# Altium schematic sheet P04 Power 1.SchDoc
size 420 x 297 mm
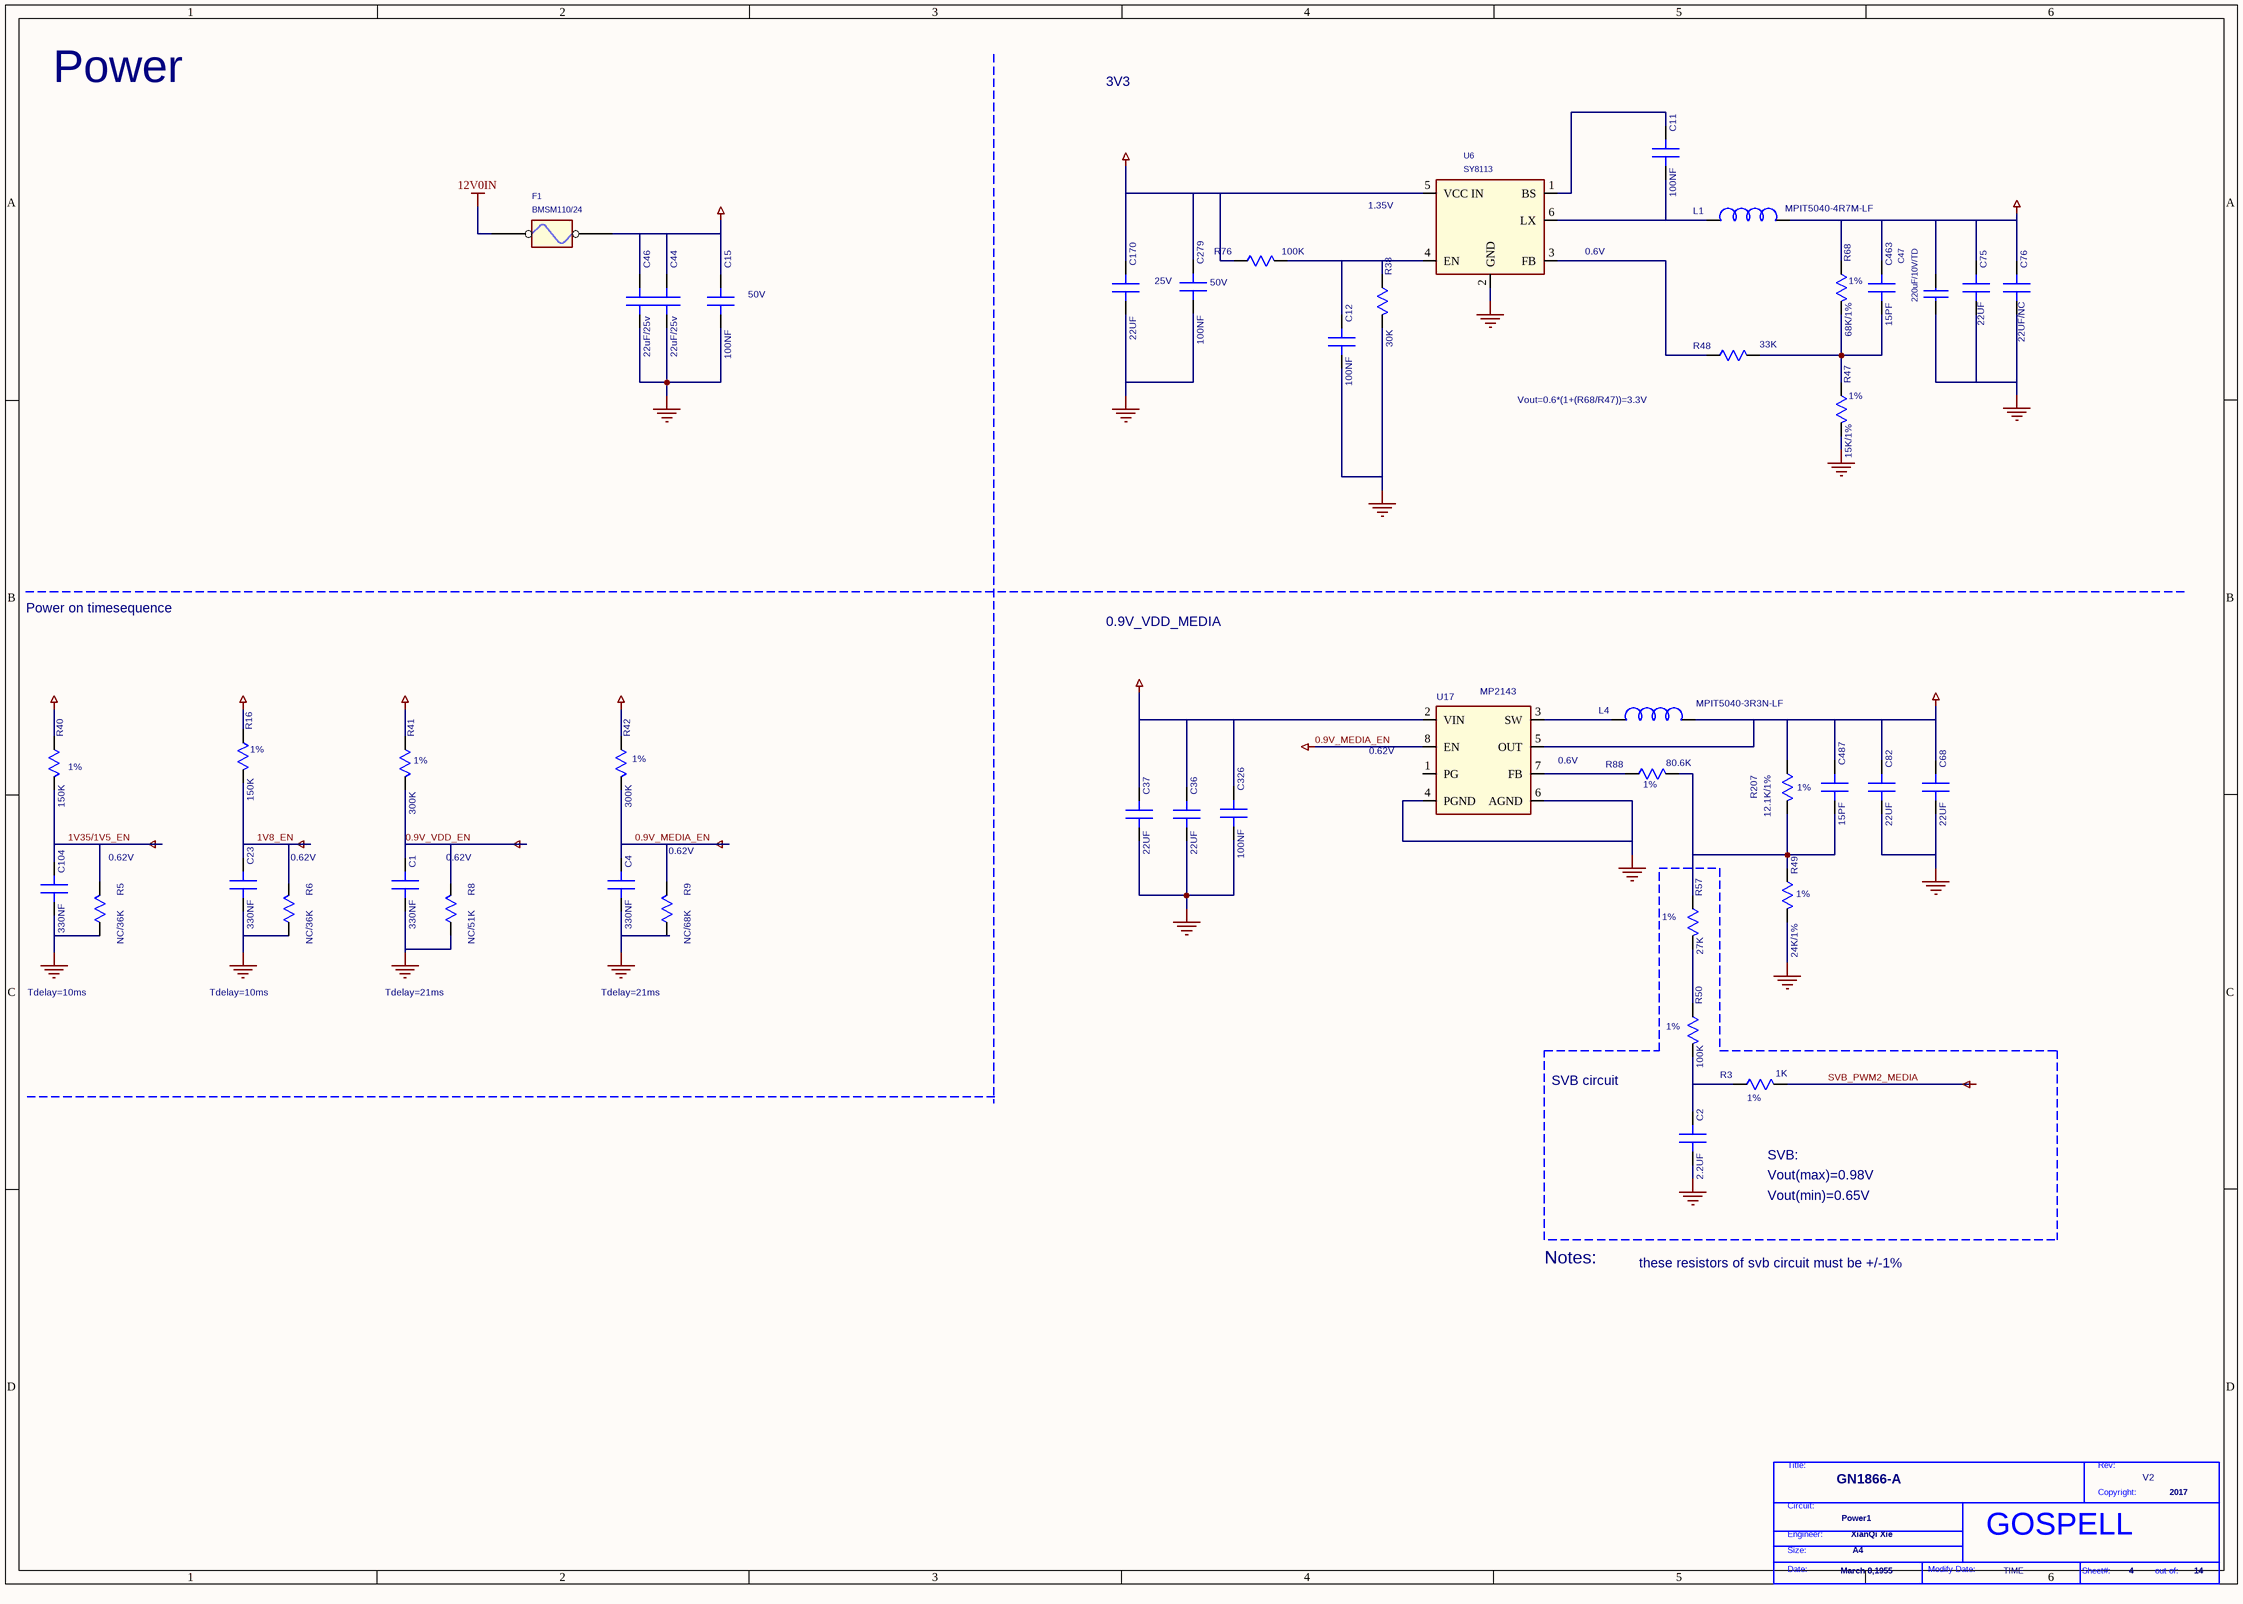
[diagram p0: P04 Power 1.SchDoc]

## Parts
*  Page Modify Date: TIME  Engineer: XianQi Xie  Copyright: 2017  Title: GN1866-A  RevCode: V2  Page Size: A4  Page Create Date: March 8,1955  Page Number: 4  Page Count: 14  Doc: Power1  (hidden comment: GOSPELL)  (graphical)
C1  330NF  [SC0402]
C2  2.2UF  [HSC0402]
C4  330NF  [SC0402]
C11  100NF  [SC0402]
C12  100NF  [SC0402]
C15  100NF  [SC0402]
C23  330NF  [SC0402]
C36  22UF  [SC1206]
C37  22UF  [SC1206]
C44  22uF/25v  [1210]
C46  22uF/25v  [1210]
C47  220uF/10V/TD  [C6032]
C68  22UF  [SC1206]
C75  22UF  [SC1206]
C76  22UF/NC  [SC1206]
C82  22UF  [SC1206]
C104  330NF  [SC0402]
C170  22UF  [SC1206]
C279  100NF  [SC0402]
C326  100NF  [SC0402]
C463  15PF  [SC0402]
C487  15PF  [SC0402]
F1  BMSM110/24  [1812]
L1  MPIT5040-4R7M-LF  [MPI5040]
L4  MPIT5040-3R3N-LF  [MPI5040]
R3  1K  [SR0402]
R5  NC/36K  [SR0402]
R6  NC/36K  [SR0402]
R8  NC/51K  [SR0402]
R9  NC/68K  [SR0402]
R16  150K  [SR0402]
R38  30K  [SR0402]
R40  150K  [SR0402]
R41  300K  [SR0402]
R42  300K  [SR0402]
R47  15K/1%  [SR0402]
R48  33K  [SR0402]
R49  24K/1%  [SR0402]
R50  100K  [SR0402]
R57  27K  [SR0402]
R68  68K/1%  [SR0402]
R76  100K  [SR0402]
R88  80.6K  [SR0402]
R207  12.1K/1%  [SR0402]
U6  SY8113  [SOT23-6]
U17  DEVICE: MP2143  [TSOT23-8]  (hidden comment: MP2161GJ)

## Nets
0.9V_MEDIA_EN: C4.1(A) R9.2(B) R42.2(B) U17.8(EN)
0.9V_VDD_EN: C1.1(A) R8.2(B) R41.2(B)
1V8_EN: C23.1(A) R6.2(B) R16.2(B)
1V35/1V5_EN: C104.1(A) R5.2(B) R40.2(B)
3V3: C36.1(A) C37.1(A) C47.1 C75.1(A) C76.1(A) C326.1(A) C463.1(A) L1.2(B) R16.1(A) R40.1(A) R41.1(A) R42.1(A) R68.1(A) U17.2(VIN)
12V0: C15.1(A) C44.1(A) C46.1(A) C170.1(A) C279.1(A) F1.2 R76.1(A) U6.5(VCC_IN)
12V0IN: F1.1
GND: C1.2(B) C2.2(B) C4.2(B) C12.2(B) C15.2(B) C23.2(B) C36.2(B) C37.2(B) C44.2(B) C46.2(B) C47.2 C68.2(B) C75.2(B) C76.2(B) C82.2(B) C104.2(B) C170.2(B) C279.2(B) C326.2(B) R5.1(A) R6.1(A) R8.1(A) R9.1(A) R38.2(B) R47.2(B) R49.2(B) U6.2(GND) U17.4(PGND) U17.6(AGND)
SVB_PWM2_MEDIA: R3.2(B)
VCC_MEDIA_CORE: C68.1(A) C82.1(A) C487.1(A) L4.2(B) R207.1(A) U17.5(OUT)
NetC2_1: C2.1(A) R3.1(A) R50.2(B)
NetC11_1: C11.1(A) U6.1(BS)
NetC11_2: C11.2(B) L1.1(A) U6.6(LX)
NetC12_1: C12.1(A) R38.1(A) R76.2(B) U6.4(EN)
NetC463_2: C463.2(B) R47.1(A) R48.2(B) R68.2(B)
NetC487_2: C487.2(B) R49.1(A) R57.1(A) R88.2(B) R207.2(B)
NetL4_1: L4.1(A) U17.3(SW)
NetR48_1: R48.1(A) U6.3(FB)
NetR50_1: R50.1(A) R57.2(B)
NetR88_1: R88.1(A) U17.7(FB)

Not connected (* = marked no-connect by the designer): U17 1(PG)

## Notes on the sheet
- Power
- 3V3
- (near U6) 1.35V
- (near U6) 0.6V
- (near C15) 50V
- 25V
- (near C279) 50V
- (near R68) 1%
- (near R47) 1%
- Vout=0.6*(1+(R68/R47))=3.3V
- Power on timesequence
- 0.9V_VDD_MEDIA
- (near R40) 1%
- (near R16) 1%
- (near R41) 1%
- (near R42) 1%
- (near U17) 0.62V
- (near U17) 0.6V
- (near R88) 1%
- (near R207) 1%
- (near R5) 0.62V
- 0.62V
- (near R57) 1%
- (near R49) 1%
- Tdelay=10ms
- Tdelay=21ms
- (near R50) 1%
- SVB circuit
- (near R3) 1%
- Vout(min)=0.65V
- Vout(max)=0.98V
- SVB:
- Notes:
- these resistors of svb circuit must be +/-1%
- (in symbol GOSPELL) Title:; Rev:; Copyright:; Circuit:; Engineer:; Size:; Date:; Modify Date:; Sheet#:; out of:

## Library data of the parts
C1 = C_0_Dup2: PARTS: 1; OriginalSymbolOrigin: (0,30); DEVICE: C0603C334K4RAC7867; PKG_TYPE: SC0603; LEVEL: STD; PINSWAP: (A,B); GVALUE: C 16V  0.33uF +80%~-20%  X7R 0402; CODE: 8070857; %195%%232%%202%%246%: SMD陶瓷电容-16V-330NF-+/-10%-X7R-0603-所有; %182%%238%%182%%168%%185%%164%%215%%247%%181%%231%%209%%185%(V): 16; COMPONENT_HIGH_MAX: 0.9MM; %208%%161%%192%%224%%195%%251%%179%%198%: SMD陶瓷电容
C2 = C_0_Dup2: PARTS: 1; OriginalSymbolOrigin: (0,30); DEVICE: GRM155R60J225ME15D; LEVEL: STD; PINSWAP: (A,B); CODE: 8070667; %195%%232%%202%%246%: SMD陶瓷电容-6.3V-2200NF-+/-20%-X5R-0402-TS16949; %182%%238%%182%%168%%185%%164%%215%%247%%181%%231%%209%%185%(V): 6.3; COMPONENT_HIGH_MAX: 0.6MM; %208%%161%%192%%224%%195%%251%%179%%198%: SMD陶瓷电容; GVALUE: C  6.3V  2.2uF +80%~-20%  X5R 0402; PKG_TYPE: HSC0402
C4 C23 C104 = C_0_Dup2: PARTS: 1; OriginalSymbolOrigin: (0,30); DEVICE: C0603C334K4RAC7867; PKG_TYPE: SC0603; LEVEL: STD; PINSWAP: (A,B); GVALUE: C 16V  0.33uF +80%~-20%  X7R 0402; %208%%161%%192%%224%%195%%251%%179%%198%: SMD陶瓷电容; COMPONENT_HIGH_MAX: 0.9MM; %182%%238%%182%%168%%185%%164%%215%%247%%181%%231%%209%%185%(V): 16; %195%%232%%202%%246%: SMD陶瓷电容-16V-330NF-+/-10%-X7R-0603-所有; CODE: 8070857
C11 = C_0_Dup2: PARTS: 1; OriginalSymbolOrigin: (0,30); DEVICE: RMEMK105BJ104KV_FR; LEVEL: STD; PINSWAP: (A,B); GVALUE: C 16V  0.1uF +80%~-20%  X7R 0402; %208%%161%%192%%224%%195%%251%%179%%198%: SMD陶瓷电容; COMPONENT_HIGH_MAX: 0.55MM; %182%%238%%182%%168%%185%%164%%215%%247%%181%%231%%209%%185%(V): 16; %195%%232%%202%%246%: SMD陶瓷电容-16V-100NF-+/-10%-X7R-0402-BT; CODE: 8070614; PKG_TYPE: SC0402
C12 = C_0_Dup2: PARTS: 1; OriginalSymbolOrigin: (0,30); DEVICE: RMEMK105BJ104KV_FR; LEVEL: STD; PINSWAP: (A,B); GVALUE: C 16V  0.1uF +80%~-20%  X7R 0402; CODE: 8070614; %195%%232%%202%%246%: SMD陶瓷电容-16V-100NF-+/-10%-X7R-0402-BT; %182%%238%%182%%168%%185%%164%%215%%247%%181%%231%%209%%185%(V): 16; COMPONENT_HIGH_MAX: 0.55MM; %208%%161%%192%%224%%195%%251%%179%%198%: SMD陶瓷电容; PKG_TYPE: SC0402
C15 = C_0_Dup2: PARTS: 1; OriginalSymbolOrigin: (0,30); DEVICE: C1608X7R1H104KT000N; PKG_TYPE: SC0603; LEVEL: STD; PINSWAP: (A,B); GVALUE: C 16V  0.1uF +80%~-20%  X7R 0402; CODE: 8070627; %195%%232%%202%%246%: SMD陶瓷电容-50V-100NF-+/-10%-X7R-0603; %182%%238%%182%%168%%185%%164%%215%%247%%181%%231%%209%%185%(V): 50; COMPONENT_HIGH_MAX: 0.95MM; %208%%161%%192%%224%%195%%251%%179%%198%: SMD陶瓷电容
C36 C82 = C_0_Dup2: PARTS: 1; OriginalSymbolOrigin: (0,30); DEVICE: C3216X6S0J476MTJ00N; LEVEL: STD; PINSWAP: (A,B); %208%%161%%192%%224%%195%%251%%179%%198%: SMD陶瓷电容; COMPONENT_HIGH_MAX: 1.8MM; %182%%238%%182%%168%%185%%164%%215%%247%%181%%231%%209%%185%(V): 6.3; %195%%232%%202%%246%: SMD陶瓷电容-6.3V-47000NF-+/-20%-X6S-1206-供电专用; CODE: 8071639; GVALUE: C  6.3V  22uF +80%~-20%  X5R 1206; PKG_TYPE: SC1206
C37 C68 = C_0_Dup2: PARTS: 1; OriginalSymbolOrigin: (0,30); DEVICE: CEJMK316B7226ML_T; LEVEL: STD; PINSWAP: (A,B); %208%%161%%192%%224%%195%%251%%179%%198%: SMD陶瓷电容; COMPONENT_HIGH_MAX: 1.8MM; %182%%238%%182%%168%%185%%164%%215%%247%%181%%231%%209%%185%(V): 6.3; %195%%232%%202%%246%: SMD陶瓷电容-6.3V-22000NF-+/-20%-X7R-1206-所有; CODE: 8070862; GVALUE: C  6.3V  22uF +80%~-20%  X5R 1206; PKG_TYPE: SC1206
C44 = C_0_Dup2: PARTS: 1; OriginalSymbolOrigin: (0,30); DEVICE: C1608X7R1H104KT000N; PKG_TYPE: SC0603; LEVEL: STD; PINSWAP: (A,B); %208%%161%%192%%224%%195%%251%%179%%198%: SMD陶瓷电容; COMPONENT_HIGH_MAX: 0.95MM; %182%%238%%182%%168%%185%%164%%215%%247%%181%%231%%209%%185%(V): 50; %195%%232%%202%%246%: SMD陶瓷电容-50V-100NF-+/-10%-X7R-0603; CODE: 8070627; GVALUE: C  25V  22uF +80%~-20%  X7R 1210
C46 = C_0_Dup2: PARTS: 1; OriginalSymbolOrigin: (0,30); DEVICE: C1608X7R1H104KT000N; PKG_TYPE: SC0603; LEVEL: STD; PINSWAP: (A,B); GVALUE: C  25V  22uF +80%~-20%  X7R 1210; CODE: 8070627; %195%%232%%202%%246%: SMD陶瓷电容-50V-100NF-+/-10%-X7R-0603; %182%%238%%182%%168%%185%%164%%215%%247%%181%%231%%209%%185%(V): 50; COMPONENT_HIGH_MAX: 0.95MM; %208%%161%%192%%224%%195%%251%%179%%198%: SMD陶瓷电容
C47 = CAP NP: GVALUE: CT 6.3V/220uF±20% 6032
C75 = C_0_Dup2: PARTS: 1; OriginalSymbolOrigin: (0,30); DEVICE: C3216X6S0J476MTJ00N; LEVEL: STD; PINSWAP: (A,B); CODE: 8071639; %195%%232%%202%%246%: SMD陶瓷电容-6.3V-47000NF-+/-20%-X6S-1206-供电专用; %182%%238%%182%%168%%185%%164%%215%%247%%181%%231%%209%%185%(V): 6.3; COMPONENT_HIGH_MAX: 1.8MM; %208%%161%%192%%224%%195%%251%%179%%198%: SMD陶瓷电容; GVALUE: C  6.3V  22uF +80%~-20%  X5R 1206; PKG_TYPE: SC1206
C76 = C_0_Dup2: PARTS: 1; OriginalSymbolOrigin: (0,30); DEVICE: CEJMK316B7226ML_T; LEVEL: STD; PINSWAP: (A,B); %208%%161%%192%%224%%195%%251%%179%%198%: SMD陶瓷电容; COMPONENT_HIGH_MAX: 1.8MM; %182%%238%%182%%168%%185%%164%%215%%247%%181%%231%%209%%185%(V): 6.3; %195%%232%%202%%246%: SMD陶瓷电容-6.3V-22000NF-+/-20%-X7R-1206-所有; CODE: 8070862; GVALUE: NC; PKG_TYPE: SC1206
C170 = C_0_Dup2: PARTS: 1; OriginalSymbolOrigin: (0,30); DEVICE: CETMK325B7226KM_T; PKG_TYPE: SC1210; LEVEL: STD; PINSWAP: (A,B); %208%%161%%192%%224%%195%%251%%179%%198%: SMD陶瓷电容; COMPONENT_HIGH_MAX: 2.7MM; %182%%238%%182%%168%%185%%164%%215%%247%%181%%231%%209%%185%(V): 25; %195%%232%%202%%246%: SMD陶瓷电容-25V-22000NF-+/-10%-X7R-1210-所有; CODE: 8070825; GVALUE: C  6.3V  22uF +80%~-20%  X5R 1206
C279 = C_0_Dup2: PARTS: 1; OriginalSymbolOrigin: (0,30); DEVICE: C1608X7R1H104KT000N; PKG_TYPE: SC0603; LEVEL: STD; PINSWAP: (A,B); GVALUE: C 16V  0.1uF +80%~-20%  X7R 0402; %208%%161%%192%%224%%195%%251%%179%%198%: SMD陶瓷电容; COMPONENT_HIGH_MAX: 0.9MM; %182%%238%%182%%168%%185%%164%%215%%247%%181%%231%%209%%185%(V): 50; %195%%232%%202%%246%: SMD陶瓷电容-50V-100NF-+/-10%-X7R-0603; CODE: 8070627
C326 = C_0_Dup2: PARTS: 1; OriginalSymbolOrigin: (0,30); DEVICE: C1608X7R1H104KT000N; PKG_TYPE: SC0603; LEVEL: STD; PINSWAP: (A,B); GVALUE: C 16V  0.1uF +80%~-20%  X7R 0402; CODE: 8070627; %195%%232%%202%%246%: SMD陶瓷电容-50V-100NF-+/-10%-X7R-0603; %182%%238%%182%%168%%185%%164%%215%%247%%181%%231%%209%%185%(V): 50; COMPONENT_HIGH_MAX: 0.9MM; %208%%161%%192%%224%%195%%251%%179%%198%: SMD陶瓷电容
C463 = C_0_Dup2: PARTS: 1; OriginalSymbolOrigin: (0,30); DEVICE: C0402C150J5GAC_7867; LEVEL: STD; PINSWAP: (A,B); CODE: 8070544; %195%%232%%202%%246%: SMD陶瓷电容-50V-0.015NF-+/-5%-NP0-0402; %182%%238%%182%%168%%185%%164%%215%%247%%181%%231%%209%%185%(V): 50; COMPONENT_HIGH_MAX: 0.55MM; %208%%161%%192%%224%%195%%251%%179%%198%: SMD陶瓷电容; GVALUE: C  50V  15pF +80%~-20% NP0 0402; PKG_TYPE: SC0402
C487 = C_0_Dup2: PARTS: 1; OriginalSymbolOrigin: (0,30); DEVICE: C0402C150J5GAC_7867; LEVEL: STD; PINSWAP: (A,B); %208%%161%%192%%224%%195%%251%%179%%198%: SMD陶瓷电容; COMPONENT_HIGH_MAX: 0.55MM; %182%%238%%182%%168%%185%%164%%215%%247%%181%%231%%209%%185%(V): 50; %195%%232%%202%%246%: SMD陶瓷电容-50V-0.015NF-+/-5%-NP0-0402; CODE: 8070544; GVALUE: C  50V  15pF +80%~-20% NP0 0402; PKG_TYPE: SC0402
F1 = FUSEHOLDER: GVALUE: BMSM110/24 快恢复保险PPTC 24V/1.1A 1812
L1 = L_0: PARTS: 1; OriginalSymbolOrigin: (20,20); PKG_TYPE: SL2828; LEVEL: STD; DEVICE: TGSDRH6D38_4R7N; %208%%161%%192%%224%%195%%251%%179%%198%: 贴片电感器; COMPONENT_HIGH_MAX: 4MM; %195%%232%%202%%246%: 贴片电感器-4.7UH-+/-30%-0.032OHM-4A-30DEGC MAX-7.0*7.0*4.0MM-使用温度范围包括电感温升,工艺耐温250DEGC; CODE: 10031094; GVALUE: 麦捷:MPIT5040-4R7M-LF
L4 = L_0: PARTS: 1; OriginalSymbolOrigin: (20,20); PKG_TYPE: SPL0404B; LEVEL: STD; DEVICE: NRS4018T1R0NDGJ; %208%%161%%192%%224%%195%%251%%179%%198%: 贴片电感器; COMPONENT_HIGH_MAX: 2.1MM; %195%%232%%202%%246%: 贴片电感器-1UH-30%-0.0324OHM-4A-40DEGC-4*4*2MM; CODE: 10031357; GVALUE: 麦捷:MPIT5040-3R3N-LF
R3 = R_0: PARTS: 1; OriginalSymbolOrigin: (10,20); PINSWAP: (A,B); DEVICE: RK73H1JTTD1001F; PKG_TYPE: SR0603; LEVEL: STD; %208%%161%%192%%224%%195%%251%%179%%198%: 片式厚膜电阻器; COMPONENT_HIGH_MAX: 0.55MM; %215%%232%%214%%181%%212%%202%%208%%237%%198%%171%%178%%238%: +/-1%; %182%%238%%182%%168%%185%%166%%194%%202%(W): 0.1; %195%%232%%202%%246%: 片式厚膜电阻器-0.1W-1000OHM-+/-1%-0603; CODE: 7090885; GVALUE: R 1/16W 1K±5% 0402
R5 R8 = R_0: PARTS: 1; OriginalSymbolOrigin: (10,20); PINSWAP: (A,B); DEVICE: RC0603JR_07510R; PKG_TYPE: SR0603; LEVEL: STD; CODE: 7090638; %195%%232%%202%%246%: 片式厚膜电阻器-0.1W-510OHM-+/-5%-0603; %182%%238%%182%%168%%185%%166%%194%%202%(W): 0.1; %215%%232%%214%%181%%212%%202%%208%%237%%198%%171%%178%%238%: +/-5%; COMPONENT_HIGH_MAX: 0.55MM; %208%%161%%192%%224%%195%%251%%179%%198%: 片式厚膜电阻器; GVALUE: NC
R6 R9 = R_0: PARTS: 1; OriginalSymbolOrigin: (10,20); PINSWAP: (A,B); DEVICE: RC0603JR_07510R; PKG_TYPE: SR0603; LEVEL: STD; %208%%161%%192%%224%%195%%251%%179%%198%: 片式厚膜电阻器; COMPONENT_HIGH_MAX: 0.55MM; %215%%232%%214%%181%%212%%202%%208%%237%%198%%171%%178%%238%: +/-5%; %182%%238%%182%%168%%185%%166%%194%%202%(W): 0.1; %195%%232%%202%%246%: 片式厚膜电阻器-0.1W-510OHM-+/-5%-0603; CODE: 7090638; GVALUE: NC
R16 = R_0: PARTS: 1; OriginalSymbolOrigin: (10,20); PINSWAP: (A,B); DEVICE: RK73B1ELTP104J; LEVEL: STD; GVALUE: R 1/16W 150K±5% 0402; %208%%161%%192%%224%%195%%251%%179%%198%: 片式厚膜电阻器; COMPONENT_HIGH_MAX: 0.4MM; %215%%232%%214%%181%%212%%202%%208%%237%%198%%171%%178%%238%: +/-5%; %182%%238%%182%%168%%185%%166%%194%%202%(W): 0.06; %195%%232%%202%%246%: 片式厚膜电阻器-0.0625W-100000OHM-+/-5%-0402-BT; CODE: 7090831; PKG_TYPE: SR0402
R38 = R_0: PARTS: 1; OriginalSymbolOrigin: (10,20); PINSWAP: (A,B); DEVICE: RK73B1ELTP104J; LEVEL: STD; CODE: 7090831; %195%%232%%202%%246%: 片式厚膜电阻器-0.0625W-100000OHM-+/-5%-0402-BT; %182%%238%%182%%168%%185%%166%%194%%202%(W): 0.06; %215%%232%%214%%181%%212%%202%%208%%237%%198%%171%%178%%238%: +/-5%; COMPONENT_HIGH_MAX: 0.37MM; %208%%161%%192%%224%%195%%251%%179%%198%: 片式厚膜电阻器; GVALUE: R 1/16W 30K±5% 0402; PKG_TYPE: SR0402
R40 = R_0: PARTS: 1; OriginalSymbolOrigin: (10,20); PINSWAP: (A,B); DEVICE: RK73B1ELTP104J; LEVEL: STD; %208%%161%%192%%224%%195%%251%%179%%198%: 片式厚膜电阻器; COMPONENT_HIGH_MAX: 0.4MM; %215%%232%%214%%181%%212%%202%%208%%237%%198%%171%%178%%238%: +/-5%; %182%%238%%182%%168%%185%%166%%194%%202%(W): 0.06; %195%%232%%202%%246%: 片式厚膜电阻器-0.0625W-100000OHM-+/-5%-0402-BT; CODE: 7090831; GVALUE: R 1/16W 150K±5% 0402; PKG_TYPE: SR0402
R41 = R_0: PARTS: 1; OriginalSymbolOrigin: (10,20); PINSWAP: (A,B); DEVICE: RC0402JR_07220K; LEVEL: STD; CODE: 7090608; %195%%232%%202%%246%: 片式厚膜电阻器-0.0625W-220000OHM-+/-5%-0402; %182%%238%%182%%168%%185%%166%%194%%202%(W): 0.06; %215%%232%%214%%181%%212%%202%%208%%237%%198%%171%%178%%238%: +/-5%; COMPONENT_HIGH_MAX: 0.4MM; %208%%161%%192%%224%%195%%251%%179%%198%: 片式厚膜电阻器; GVALUE: R 1/16W 300K±5% 0402; PKG_TYPE: SR0402
R42 = R_0: PARTS: 1; OriginalSymbolOrigin: (10,20); PINSWAP: (A,B); DEVICE: RC0603JR_07300K; PKG_TYPE: SR0603; LEVEL: STD; %208%%161%%192%%224%%195%%251%%179%%198%: 片式厚膜电阻器; COMPONENT_HIGH_MAX: 0.55MM; %215%%232%%214%%181%%212%%202%%208%%237%%198%%171%%178%%238%: +/-5%; %182%%238%%182%%168%%185%%166%%194%%202%(W): 0.1; %195%%232%%202%%246%: 片式厚膜电阻器-0.1W-300000OHM-+/-5%-0603; CODE: 7090261; GVALUE: R 1/16W 300K±5% 0402
R47 = R_0: PARTS: 1; OriginalSymbolOrigin: (10,20); PINSWAP: (A,B); DEVICE: RC0603FR_0710K7; PKG_TYPE: SR0603; LEVEL: STD; %208%%161%%192%%224%%195%%251%%179%%198%: 片式厚膜电阻器; COMPONENT_HIGH_MAX: 0.55MM; %215%%232%%214%%181%%212%%202%%208%%237%%198%%171%%178%%238%: +/-1%; %182%%238%%182%%168%%185%%166%%194%%202%(W): 0.1; %195%%232%%202%%246%: 片式厚膜电阻器-0.1W-10700OHM-+/-1%-0603; CODE: 7090969; GVALUE: R 1/16W 15K±1% 0402
R48 = R_0: PARTS: 1; OriginalSymbolOrigin: (10,20); PINSWAP: (A,B); DEVICE: RK73B1ELTP333J; LEVEL: STD; CODE: 7090828; %195%%232%%202%%246%: 片式厚膜电阻器-0.0625W-33000OHM-+/-5%-0402; %182%%238%%182%%168%%185%%166%%194%%202%(W): 0.06; %215%%232%%214%%181%%212%%202%%208%%237%%198%%171%%178%%238%: +/-5%; COMPONENT_HIGH_MAX: 0.4MM; %208%%161%%192%%224%%195%%251%%179%%198%: 片式厚膜电阻器; GVALUE: R 1/16W 33K±1% 0402; PKG_TYPE: SR0402
R49 = R_0: PARTS: 1; OriginalSymbolOrigin: (10,20); PINSWAP: (A,B); DEVICE: RC_02W2402FT; LEVEL: STD; CODE: 7091376; %195%%232%%202%%246%: 片式厚膜电阻器-0.0625W-24000OHM-+/-1%-0402; %182%%238%%182%%168%%185%%166%%194%%202%(W): 0.06; %215%%232%%214%%181%%212%%202%%208%%237%%198%%171%%178%%238%: +/-1%; COMPONENT_HIGH_MAX: 0.4MM; %208%%161%%192%%224%%195%%251%%179%%198%: 片式厚膜电阻器; GVALUE: R 1/16W 24K±1% 0402; PKG_TYPE: SR0402
R50 = R_0: PARTS: 1; OriginalSymbolOrigin: (10,20); PINSWAP: (A,B); DEVICE: RK73H1JTTD1003F; PKG_TYPE: SR0603; LEVEL: STD; CODE: 7090941; %195%%232%%202%%246%: 片式厚膜电阻器-0.1W-100000OHM-+/-1%-0603; %182%%238%%182%%168%%185%%166%%194%%202%(W): 0.1; %215%%232%%214%%181%%212%%202%%208%%237%%198%%171%%178%%238%: +/-1%; COMPONENT_HIGH_MAX: 0.55MM; %208%%161%%192%%224%%195%%251%%179%%198%: 片式厚膜电阻器; GVALUE: R 1/16W 100K±5% 0402
R57 = R_0: PARTS: 1; OriginalSymbolOrigin: (10,20); PINSWAP: (A,B); DEVICE: RK73H1JTTD2702F; PKG_TYPE: SR0603; LEVEL: STD; %208%%161%%192%%224%%195%%251%%179%%198%: 片式厚膜电阻器; COMPONENT_HIGH_MAX: 0.55MM; %215%%232%%214%%181%%212%%202%%208%%237%%198%%171%%178%%238%: +/-1%; %182%%238%%182%%168%%185%%166%%194%%202%(W): 0.1; %195%%232%%202%%246%: 片式厚膜电阻器-0.1W-27000OHM-+/-1%-0603; CODE: 7090937; GVALUE: R 1/16W 27K±5% 0402
R68 = R_0: PARTS: 1; OriginalSymbolOrigin: (10,20); PINSWAP: (A,B); DEVICE: RC0603FR_0733K2; PKG_TYPE: SR0603; LEVEL: STD; GVALUE: R 1/16W 68K±1% 0402; CODE: 7090766; %195%%232%%202%%246%: 片式厚膜电阻器-0.1W-33200OHM-+/-1%-0603; %182%%238%%182%%168%%185%%166%%194%%202%(W): 0.1; %215%%232%%214%%181%%212%%202%%208%%237%%198%%171%%178%%238%: +/-1%; COMPONENT_HIGH_MAX: 0.55MM; %208%%161%%192%%224%%195%%251%%179%%198%: 片式厚膜电阻器
R76 = R_0: PARTS: 1; OriginalSymbolOrigin: (10,20); PINSWAP: (A,B); DEVICE: RK73B1ELTP104J; LEVEL: STD; CODE: 7090831; %195%%232%%202%%246%: 片式厚膜电阻器-0.0625W-100000OHM-+/-5%-0402-BT; %182%%238%%182%%168%%185%%166%%194%%202%(W): 0.06; %215%%232%%214%%181%%212%%202%%208%%237%%198%%171%%178%%238%: +/-5%; COMPONENT_HIGH_MAX: 0.37MM; %208%%161%%192%%224%%195%%251%%179%%198%: 片式厚膜电阻器; GVALUE: R 1/16W 100K±5% 0402; PKG_TYPE: SR0402
R88 = R_0: PARTS: 1; OriginalSymbolOrigin: (10,20); PINSWAP: (A,B); DEVICE: RK73H1JTTD8062F; PKG_TYPE: SR0603; LEVEL: STD; GVALUE: R 1/16W 80.6K±1% 0402; CODE: 7090931; %195%%232%%202%%246%: 片式厚膜电阻器-0.1W-80600OHM-+/-1%-0603; %182%%238%%182%%168%%185%%166%%194%%202%(W): 0.1; COMPONENT_HIGH_MAX: 0.55MM; %208%%161%%192%%224%%195%%251%%179%%198%: 片式厚膜电阻器
R207 = R_0: PARTS: 1; OriginalSymbolOrigin: (10,20); PINSWAP: (A,B); DEVICE: RK73H1JTTD1272F; PKG_TYPE: SR0603; LEVEL: STD; CODE: 7090924; %195%%232%%202%%246%: 片式厚膜电阻器-0.1W-12700OHM-+/-1%-0603; %182%%238%%182%%168%%185%%166%%194%%202%(W): 0.1; %215%%232%%214%%181%%212%%202%%208%%237%%198%%171%%178%%238%: +/-1%; COMPONENT_HIGH_MAX: 0.55MM; %208%%161%%192%%224%%195%%251%%179%%198%: 片式厚膜电阻器; GVALUE: R 1/16W 12.1K±1% 0402
U6 = SY8120: GVALUE: 电源调整管 SY8113 SOT23-6
U17 = MP2161GJ_0: PARTS: 1; OriginalSymbolOrigin: (20,90); LEVEL: STD; COMPONENT_HIGH_MAX: 1MM; CODE: HBVT4016; GVALUE: 电源调整管 MP2161GJ TSOT23-8; FORWARD_PCB: 1; PKG_TYPE: TSOT23-8; %195%%232%%202%%246%: MP2143
* = GOSPELL: Cage Code: 2017